# Altium schematic sheet Main.SchDoc
size A4; SheetNumber: 1; SheetTotal: 13
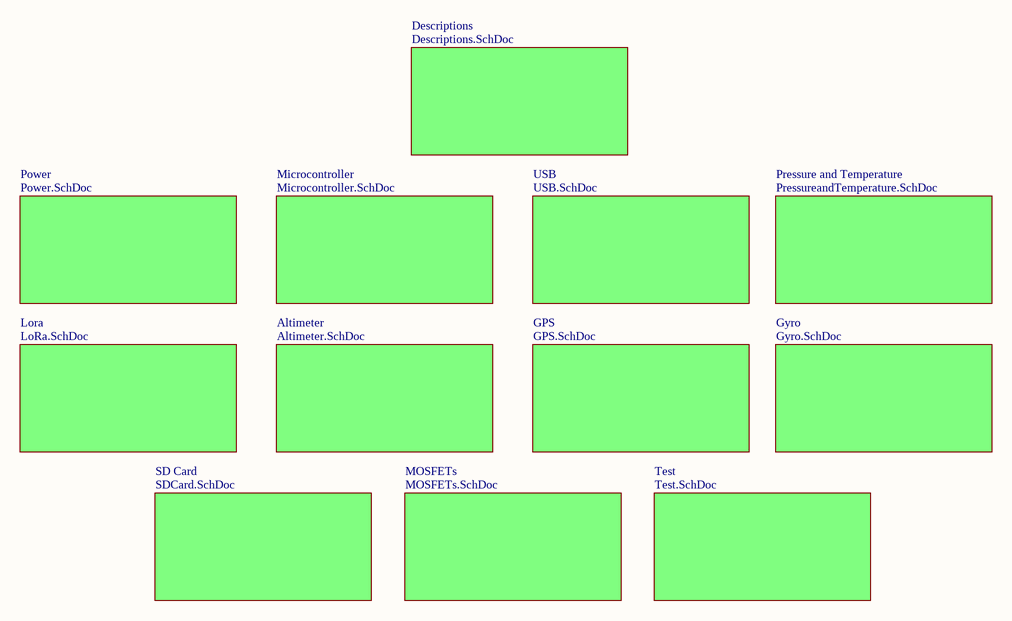
[diagram p0: Main.SchDoc]

## Sub-sheets
Altimeter = Altimeter.SchDoc: no entries
Descriptions = Descriptions.SchDoc: no entries
GPS = GPS.SchDoc: no entries
Gyro = Gyro.SchDoc: no entries
Lora = LoRa.SchDoc: no entries
Microcontroller = Microcontroller.SchDoc: no entries
MOSFETs = MOSFETs.SchDoc: no entries
Power = Power.SchDoc: no entries
Pressure and Temperature = PressureandTemperature.SchDoc: no entries
SD Card = SDCard.SchDoc: no entries
Test = Test.SchDoc: no entries
USB = USB.SchDoc: no entries

## Notes on the sheet
- Title:
- Size:
- Date:
- A4
- Number:
- Time:
- Revision:
- Sheet
- of
- Project
- Drawn By :